# EAGLE design Analog-Digital-Mux-Breakout (EAGLE 7.7.0)
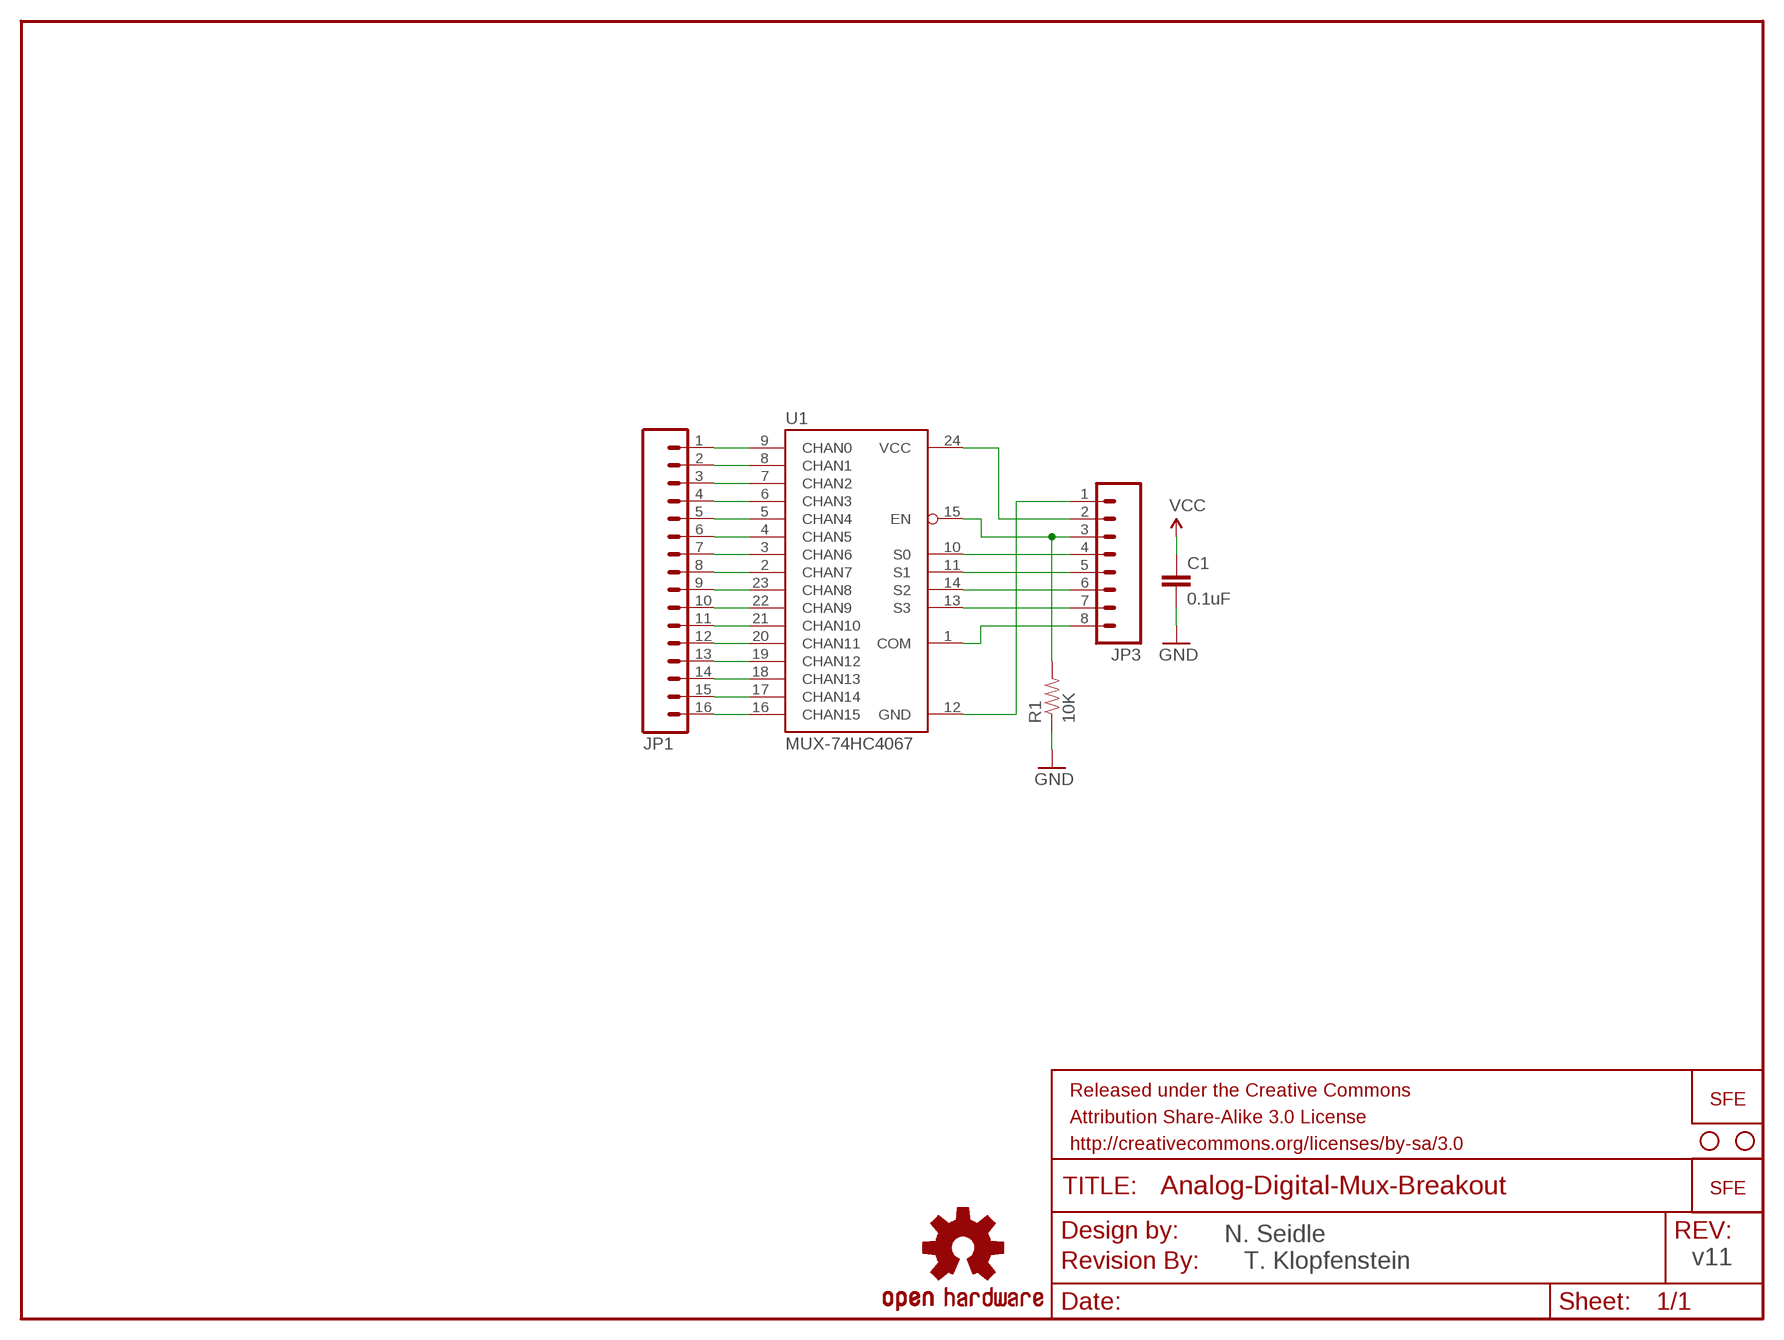
[diagram p0: schematic, sheet 1]

## Parts
C1  0.1uF  CAP0603  [0603]
FRAME1  FRAME-LETTER  [CREATIVE_COMMONS]
JP1  M16PTH  [1X16]
JP3  M081X08  [1X08]
LOGO1  OSHW-LOGOL  [OSHW-LOGO-L]
LOGO2  LOGO-SFESK  [SFE-LOGO-FLAME]
R1  10K  RESISTOR0603  [0603]
STANDOFF1  STAND-OFF  [STAND-OFF]
STANDOFF2  STAND-OFF  [STAND-OFF]
U1  MUX-74HC4067  MUX-74HC4067SMD  [SSOP24]
U$1  LOGO-SFENEW  [SFE-NEW-WEBLOGO]
U$2  REVISION  [REVISION]

## Nets
C0: JP1.1 U1.9(CHAN0)
C1: JP1.2 U1.8(CHAN1)
C2: JP1.3 U1.7(CHAN2)
C3: JP1.4 U1.6(CHAN3)
C4: JP1.5 U1.5(CHAN4)
C5: JP1.6 U1.4(CHAN5)
C6: JP1.7 U1.3(CHAN6)
C7: JP1.8 U1.2(CHAN7)
C8: JP1.9 U1.23(CHAN8)
C9: JP1.10 U1.22(CHAN9)
C10: JP1.11 U1.21(CHAN10)
C11: JP1.12 U1.20(CHAN11)
C12: JP1.13 U1.19(CHAN12)
C13: JP1.14 U1.18(CHAN13)
C14: JP1.15 U1.17(CHAN14)
C15: JP1.16 U1.16(CHAN15)
EN: JP3.3 R1.2 U1.15(EN)
GND: C1.2 JP3.1 R1.1 U1.12(GND)
S0: JP3.4 U1.10(S0)
S1: JP3.5 U1.11(S1)
S2: JP3.6 U1.14(S2)
S3: JP3.7 U1.13(S3)
SIG: JP3.8 U1.1(COM)
VCC: C1.1 JP3.2 U1.24(VCC)

## Notes on the sheet
- N. Seidle
- T. Klopfenstein | v11

## Library data of the parts
C1 = SparkFun:CAP: Capacitor Standard 0603 ceramic capacitor, and 0.1" leaded capacitor.
FRAME1 = SparkFun-Aesthetics:FRAME-LETTER: Schematic Frame Standard 8.5x11 US Letter frame
JP1 = SparkFun-Connectors:M16: 1x16 .1" header
JP3 = SparkFun-Connectors:M08: Header 8 Standard 8-pin 0.1" header. Use with straight break away headers (SKU : PRT-00116), right angle break away headers (PRT-00553), swiss pins (PRT-00743), machine pins (PRT-00117), and female headers (PRT-00115).
LOGO1 = SparkFun-Aesthetics:OSHW-LOGO: Open Source Hardware Logo This logo indicates the piece of hardware it is found on incorporates a OSHW license and/or adheres to the definition of open source hardware found here: http://freedomdefined.org/OSHW
LOGO2 = SparkFun-Aesthetics:LOGO-SFE: Spark Fun Electronics PCB Logo This is the standard Spark Fun Electronics PCB logo.
R1 = SparkFun:RESISTOR: Resistor Basic schematic elements and footprints for 0603, 1206, and PTH 1/10th watt (small) resistors.
STANDOFF1 STANDOFF2 = SparkFun-Electromechanical:STAND-OFF: #4 Stand Off This is the mechanical footprint for a #4 phillips button head screw. Use the keepout ring to avoid running the screw head into surrounding components. SKU : PRT-00447
U1 = SparkFun:MUX-74HC4067
U$1 = SparkFun:LOGO-SFE: Spark Fun Electronics PCB Logo This is the standard Spark Fun Electronics PCB logo.
U$2 = SparkFun-Aesthetics:REVISION

## Board
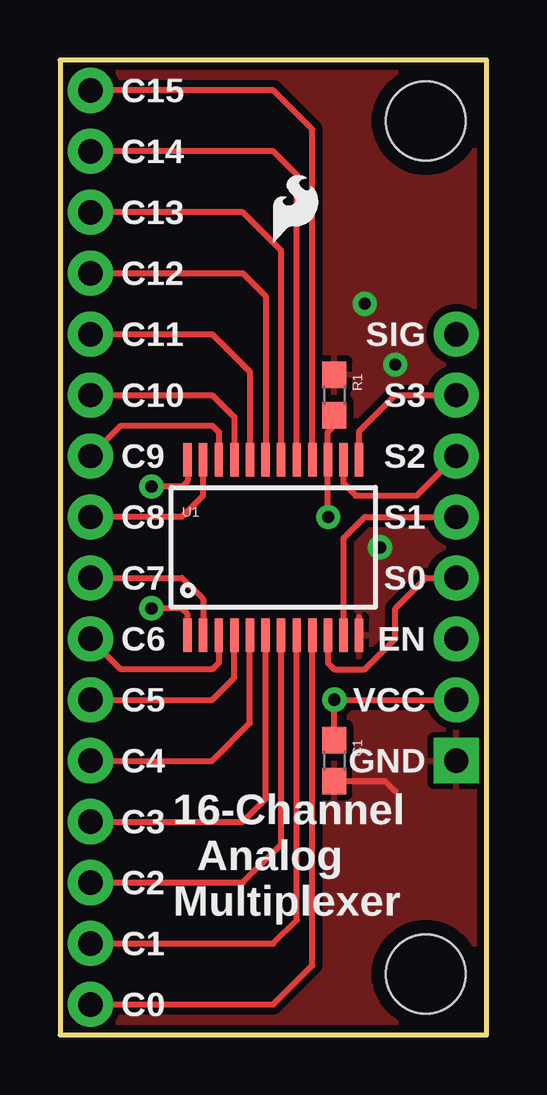
[diagram p1: board, top side]
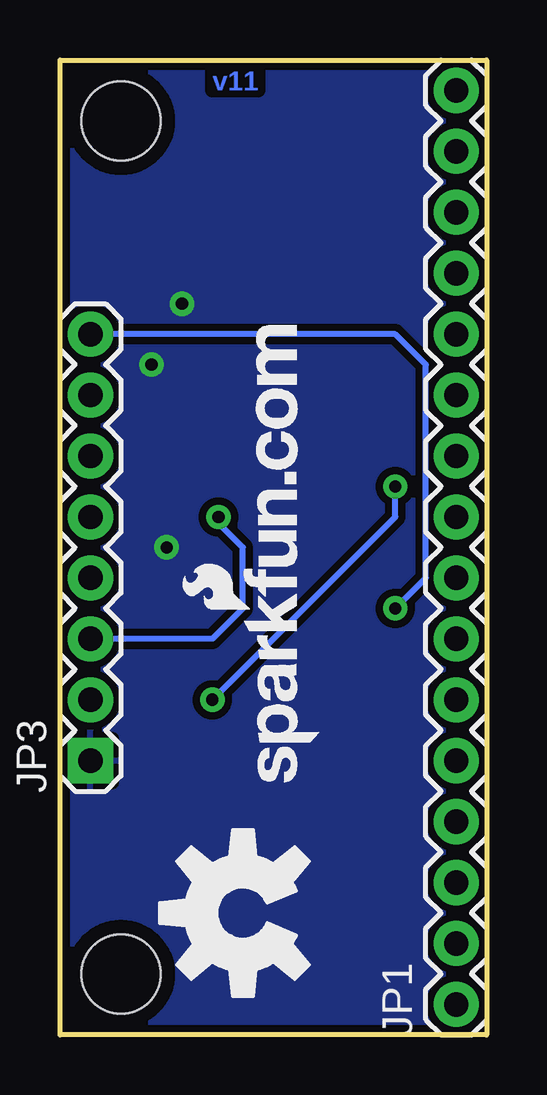
[diagram p2: board, bottom side, seen from below]

Size 17.78 x 40.64 mm. Coordinates in mm from the lower left corner, seen from the top.
Outline: 0,0 17.78,0 17.78,40.64 0,40.64 0,0
Copper layers (1*16): Top 0.035mm / dielectric 1.5mm / Bottom 0.035mm
Design rules "SparkFun": minimum track width 8mil, minimum drill 20mil, track to track 8mil, track to pad 8mil, pad to pad 8mil, via to via 8mil, smd to smd 8mil, copper to edge 10mil, drill to drill 8mil, minimum pad ring 12mil, minimum via ring 10mil, stop-mask expansion 4mil, vias tented up to drill 25mil, thermal gap 10mil

### Footprints (pad centres in the part's own frame; a part is rotated, then mirrored left to right if it is on the bottom)
0603 = smd 1.1 x 1: 1 -0.85,0; 2 0.85,0
1X16 = drill 1.016 pad 1.88: 1 0,0; 2 2.54,0; 3 5.08,0; 4 7.62,0; 5 10.16,0; 6 12.7,0; 7 15.24,0; 8 17.78,0; 9 20.32,0; 10 22.86,0; 11 25.4,0; 12 27.94,0; 13 30.48,0; 14 33.02,0; 15 35.56,0; 16 38.1,0
1X08 = drill 1.016 pad 1.88 square: 1 0,0 | drill 1.016 pad 1.88: 2 2.54,0; 3 5.08,0; 4 7.62,0; 5 10.16,0; 6 12.7,0; 7 15.24,0; 8 17.78,0
STAND-OFF = hole 3.302: 0,0
SSOP24 = smd 0.348 x 1.397: 1 -3.575,-3.656; 2 -2.925,-3.656; 3 -2.275,-3.656; 4 -1.625,-3.656; 5 -0.975,-3.656; 6 -0.325,-3.656; 7 0.325,-3.656; 8 0.975,-3.656; 9 1.625,-3.656; 10 2.275,-3.656; 11 2.925,-3.656; 12 3.575,-3.656; 13 3.575,3.656; 14 2.925,3.656; 15 2.275,3.656; 16 1.625,3.656; 17 0.975,3.656; 18 0.325,3.656; 19 -0.325,3.656; 20 -0.975,3.656; 21 -1.625,3.656; 22 -2.275,3.656; 23 -2.925,3.656; 24 -3.575,3.656

### Placement (x,y rotation side)
C1  11.43,11.43 270 top
FRAME1  -6.63,-8.89 0 top  (outside the outline)
JP1  1.27,1.27 90 bottom
JP3  16.51,11.43 90 bottom
LOGO1  10.16,5.08 90 bottom
LOGO2  8.89,33.02 0 top
R1  11.43,26.67 270 top
STANDOFF1  15.24,38.1 0 top
STANDOFF2  15.24,2.54 0 top
U1  8.89,20.32 0 top
U$1  6.99,10.54 90 bottom
U$2  4.7,-11.68 0 top  (outside the outline)

### Tracks (layer width: path | path; a pad name or v marks a point on that pad's centre or on a via)
C0
  Top 0.254: U1.9 10.52,2.9 8.89,1.27 JP1.1
C1
  Top 0.254: U1.8 9.87,4.79 8.89,3.81 JP1.2
C2
  Top 0.254: U1.7 9.21,7.95 7.62,6.35 JP1.3
C3
  Top 0.254: U1.6 8.56,9.84 7.62,8.89 JP1.4
C4
  Top 0.254: U1.5 7.92,12.99 6.35,11.43 JP1.5
C5
  Top 0.254: U1.4 7.26,14.88 6.35,13.97 JP1.6
C6
  Top 0.254: U1.3 6.62,15.51 6.35,15.24 2.54,15.24 JP1.7
C7
  Top 0.254: U1.2 5.96,18.16 5.08,19.05 JP1.8
C8
  Top 0.254: U1.23 5.96,22.48 5.08,21.59 JP1.9
C9
  Top 0.254: U1.22 6.62,25.14 6.35,25.4 2.54,25.4 JP1.10
C10
  Top 0.254: U1.21 7.26,25.75 6.35,26.67 JP1.11
C11
  Top 0.254: U1.20 7.92,27.64 6.35,29.21 JP1.12
C12
  Top 0.254: U1.19 8.56,30.8 7.62,31.75 JP1.13
C13
  Top 0.254: U1.18 9.21,32.7 7.62,34.29 JP1.14
C14
  Top 0.254: U1.17 9.87,35.85 8.89,36.83 JP1.15
C15
  Top 0.254: U1.16 10.52,37.74 8.89,39.37 JP1.16
EN  (via drill 0.51)
  Top 0.254: R1.2 11.43,25.4 11.16,25.14 U1.15 11.16,21.6 v11.18,21.59
  Bottom 0.254: JP3.3 11.43,16.51 10.16,17.78 10.16,20.32 11.18,21.34 v11.18,21.59
GND  (via drill 0.51)
  Top 0.254: U1.12 12.46,17.42 | C1.2 13.55,10.58 13.97,10.16
  other vias: 13.34,20.32 13.97,27.94 12.7,30.48
  pour Bottom (isolate 0.305): 0,0 0,40.64 17.78,40.64 17.78,0
  pour Top (isolate 0.305): 0,0 0,40.64 17.78,40.64 17.78,0
S0
  Top 0.254: U1.10 11.16,15.51 11.43,15.24 12.7,15.24 13.97,16.51 13.97,17.78 15.24,19.05 JP3.4
S1
  Top 0.254: U1.11 11.81,20.7 12.7,21.59 JP3.5
S2
  Top 0.254: U1.14 11.81,22.98 12.32,22.48 14.86,22.48 JP3.6
S3
  Top 0.254: U1.13 12.46,25.16 13.97,26.67 JP3.7
SIG  (via drill 0.51)
  Top 0.254: U1.1 5.32,17.55 5.08,17.78 v3.81,17.78
  Bottom 0.254: JP3.8 3.81,29.21 2.54,27.94 2.54,19.05 v3.81,17.78
VCC  (via drill 0.51)
  Top 0.254: C1.1 v11.43,13.97 JP3.2 | U1.24 5.32,23.09 5.08,22.86 v3.81,22.86
  Bottom 0.254: v11.43,13.97 3.81,21.59 v3.81,22.86

### Text on the board
Bottom: v11
tPlace: C15 | C14 | C13 | C12 | SIG | C11 | S3 | C10 | S2 | C9 | S1 | C8 | S0 | C7 | EN | C6 | VCC | C5 | GND | C4 | C3 | C2 | 16-Channel / Analog / Multiplexer | C1 | C0
tNames: N. Seidle | T. Klopfenstein